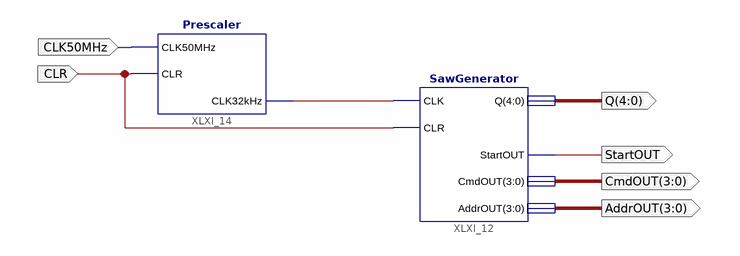
[diagram p0: schematic sheet 1]
// Xilinx ISE schematic Saw1kHz.sch (xc9500xl) as structural Verilog: 2 symbols, 6 ports
module Saw1kHz (
  input  CLK50MHz,
  input  CLR,
  output [4:0] Q,
  output StartOUT,
  output [3:0] CmdOUT,
  output [3:0] AddrOUT
);

  wire XLXN_18;

  SawGenerator XLXI_12 (.CLK(XLXN_18), .CLR(CLR), .Q(Q), .StartOUT(StartOUT), .CmdOUT(CmdOUT), .AddrOUT(AddrOUT));
  Prescaler XLXI_14 (.CLK50MHz(CLK50MHz), .CLR(CLR), .CLK32kHz(XLXN_18));
endmodule
